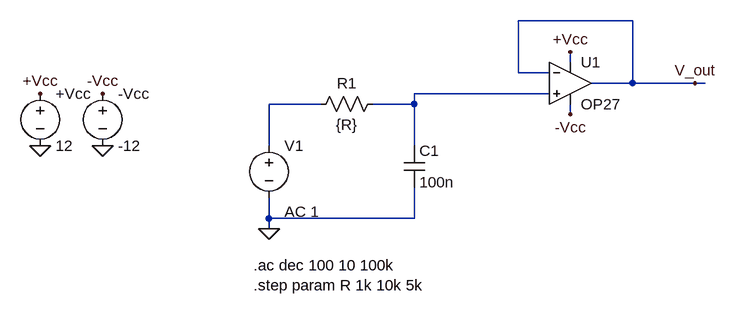
[diagram p0: schematic Low_pass.asc]
Low_pass.asc, the LTspice schematic file:
Version 4
SHEET 1 880 680
WIRE 352 -32 176 -32
WIRE 256 32 256 16
WIRE 176 48 176 -32
WIRE 224 48 176 48
WIRE 352 64 352 -32
WIRE 352 64 288 64
WIRE 448 64 352 64
WIRE 464 64 448 64
WIRE 224 80 16 80
WIRE -128 96 -208 96
WIRE 16 96 16 80
WIRE 16 96 -48 96
WIRE 256 112 256 96
WIRE -208 160 -208 96
WIRE 16 160 16 96
WIRE -208 272 -208 240
WIRE 16 272 16 224
WIRE 16 272 -208 272
WIRE -208 288 -208 272
FLAG -208 288 0
FLAG -560 160 0
FLAG -464 160 0
FLAG -560 80 +Vcc
FLAG -464 80 -Vcc
FLAG 256 16 +Vcc
FLAG 256 112 -Vcc
FLAG 448 64 V_out
SYMBOL Voltage -208 144 R0
WINDOW 123 24 118 Left 2
SYMATTR InstName V1
SYMATTR Value ""
SYMATTR Value2 AC 1
SYMBOL Res -32 80 R90
WINDOW 0 0 56 VBottom 2
WINDOW 3 32 56 VTop 2
SYMATTR InstName R1
SYMATTR Value {R}
SYMBOL Cap 0 160 R0
SYMATTR InstName C1
SYMATTR Value 100n
SYMBOL OP27 256 0 R0
SYMATTR InstName U1
SYMBOL Voltage -560 64 R0
SYMATTR InstName +Vcc
SYMATTR Value 12
SYMBOL Voltage -464 64 R0
SYMATTR InstName -Vcc
SYMATTR Value -12
TEXT -232 344 Left 2 !.ac dec 100 10 100k\n.step param R 1k 10k 5k

The netlist it stands for:
* Low_pass.asc
V1 N002 0 AC 1
R1 N001 N002 {R}
C1 N001 0 100n
XU1 N001 V_out +Vcc -Vcc V_out OP27  ; pins In+ In- V+ V- OUT
V§+Vcc +Vcc 0 12
V§-Vcc -Vcc 0 -12
.ac dec 100 10 100k
.step param R 1k 10k 5k
.lib ADI.lib
.backanno
.end